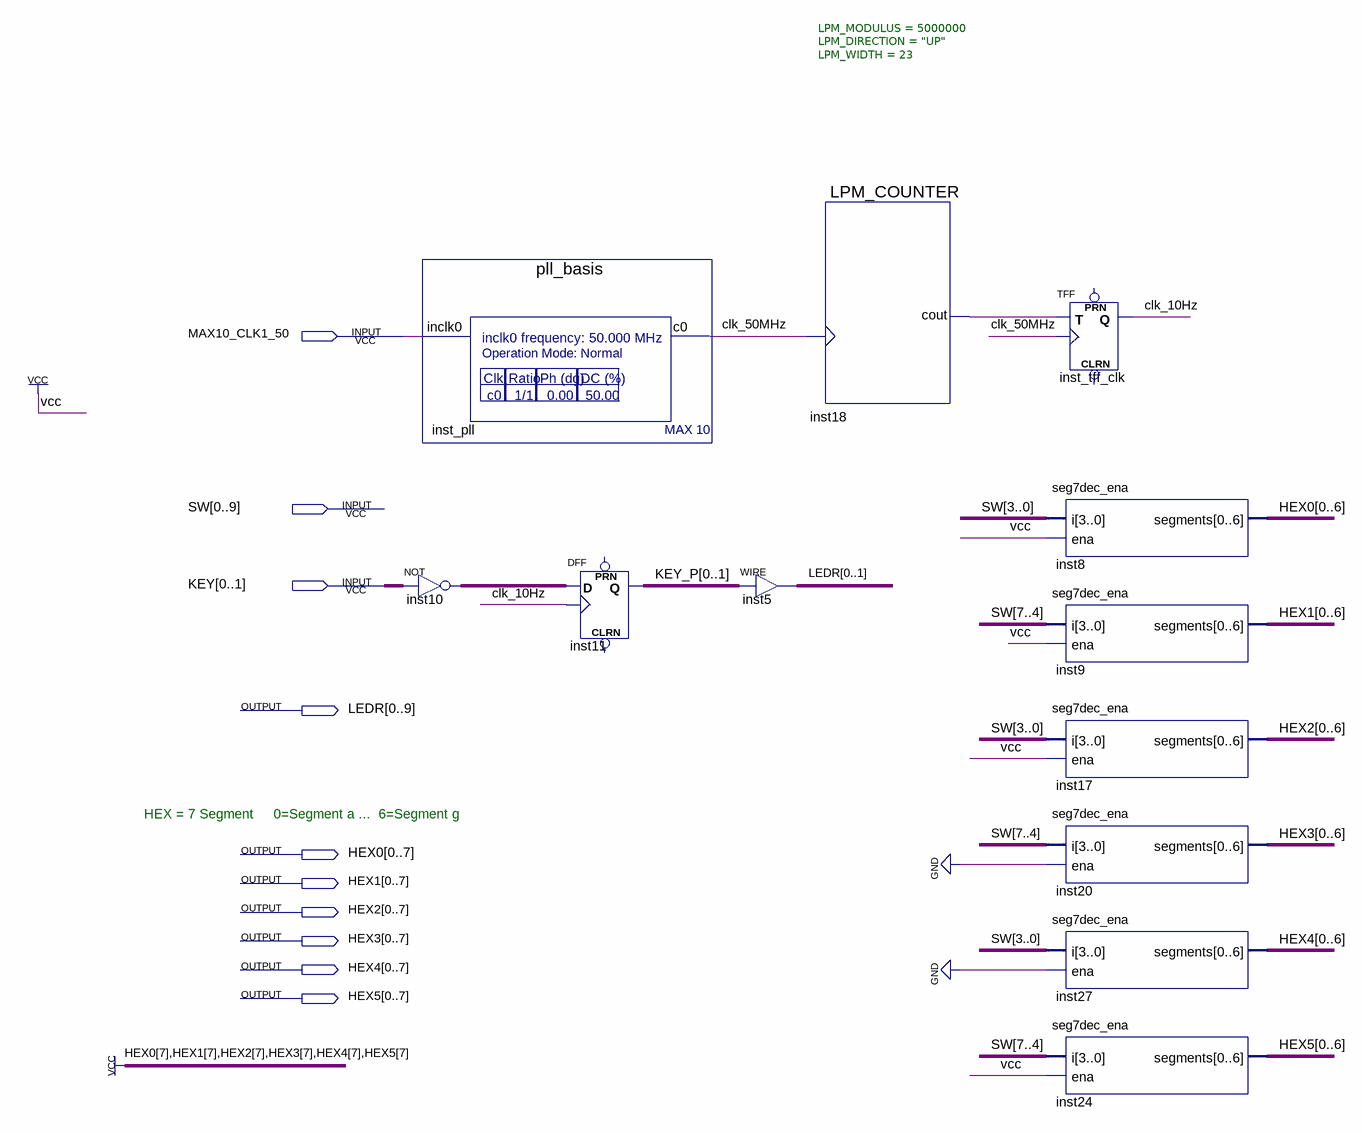
[diagram p0: schematic sheet]
// Quartus schematic de10-lite--basis.bdf as structural Verilog: 12 symbols, 10 pins
module \de10-lite--basis  (
  input  MAX10_CLK1_50,
  input  [0:9] SW,
  input  [0:1] KEY,
  output [0:9] LEDR,
  output [0:7] HEX0,
  output [0:7] HEX1,
  output [0:7] HEX2,
  output [0:7] HEX3,
  output [0:7] HEX4,
  output [0:7] HEX5
);

  wire clk_10Hz, clk_50MHz, inst18_cout;
  wire [1:0] inst10_out, KEY_P;

  pll_basis inst_pll (.inclk0(MAX10_CLK1_50), .c0(clk_50MHz));
  assign inst10_out = ~KEY;  // NOT inst10, 2 bits wide
  DFF inst11[1:0] (.CLK(clk_10Hz), .D(inst10_out), .Q({KEY_P[0], KEY_P[1]}));  // open: CLRN, PRN
  assign LEDR[0:1] = {KEY_P[0], KEY_P[1]};  // WIRE inst5
  LPM_COUNTER #(.LPM_MODULUS(5000000), .LPM_DIRECTION("UP"), .LPM_WIDTH(23)) inst18 (
    .clock(clk_50MHz), .cout(inst18_cout));
  seg7dec_ena inst8 (.ena(1'b1), .i({SW[3], SW[2], SW[1], SW[0]}), .segments(HEX0[0:6]));
  seg7dec_ena inst9 (.ena(1'b1), .i({SW[7], SW[6], SW[5], SW[4]}), .segments(HEX1[0:6]));
  seg7dec_ena inst17 (.ena(1'b1), .i({SW[3], SW[2], SW[1], SW[0]}), .segments(HEX2[0:6]));
  seg7dec_ena inst20 (.ena(1'b0), .i({SW[7], SW[6], SW[5], SW[4]}), .segments(HEX3[0:6]));
  seg7dec_ena inst27 (.ena(1'b0), .i({SW[3], SW[2], SW[1], SW[0]}), .segments(HEX4[0:6]));
  seg7dec_ena inst24 (.ena(1'b1), .i({SW[7], SW[6], SW[5], SW[4]}), .segments(HEX5[0:6]));
  TFF inst_tff_clk (.T(inst18_cout), .CLK(clk_50MHz), .Q(clk_10Hz));  // open: PRN, CLRN

  assign HEX0[7] = 1'b1;
  assign HEX1[7] = 1'b1;
  assign HEX2[7] = 1'b1;
  assign HEX3[7] = 1'b1;
  assign HEX4[7] = 1'b1;
  assign HEX5[7] = 1'b1;

  // Notes on the sheet:
  //   HEX = 7 Segment     0=Segment a ...  6=Segment g
endmodule
